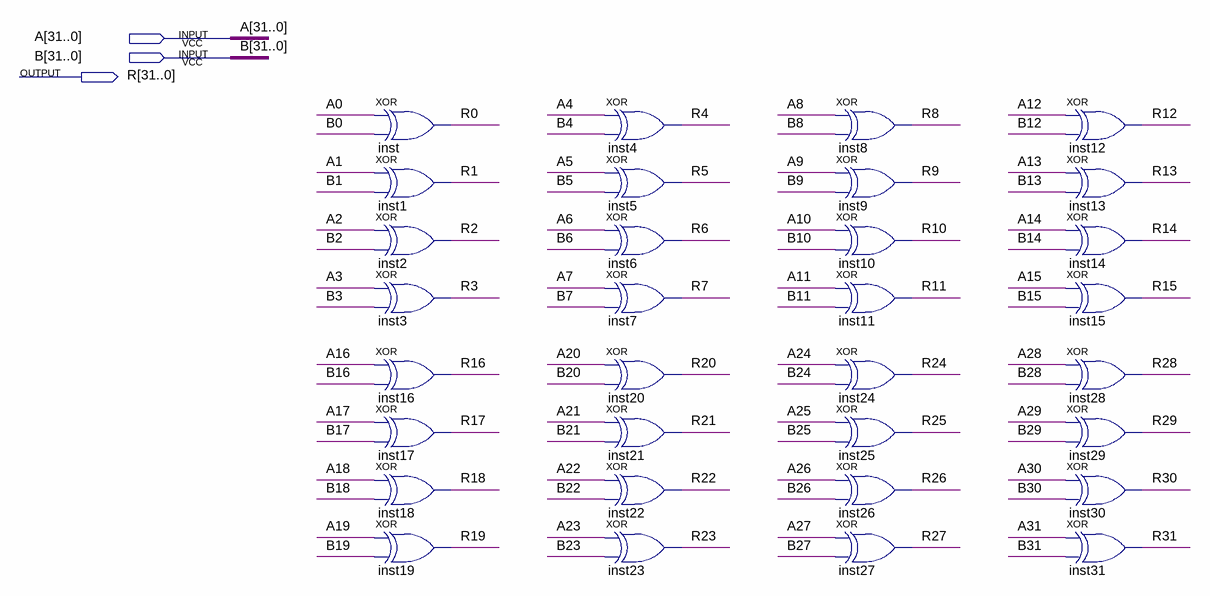
[diagram p0: schematic sheet]
// Quartus schematic xor_32_bit.bdf as structural Verilog: 32 symbols, 3 pins
module xor_32_bit (
  input  [31:0] A,
  input  [31:0] B,
  output [31:0] R
);

  xor inst (R[0], A[0], B[0]);
  xor inst1 (R[1], A[1], B[1]);
  xor inst2 (R[2], A[2], B[2]);
  xor inst3 (R[3], A[3], B[3]);
  xor inst16 (R[16], A[16], B[16]);
  xor inst17 (R[17], A[17], B[17]);
  xor inst18 (R[18], A[18], B[18]);
  xor inst19 (R[19], A[19], B[19]);
  xor inst4 (R[4], A[4], B[4]);
  xor inst5 (R[5], A[5], B[5]);
  xor inst6 (R[6], A[6], B[6]);
  xor inst7 (R[7], A[7], B[7]);
  xor inst20 (R[20], A[20], B[20]);
  xor inst21 (R[21], A[21], B[21]);
  xor inst22 (R[22], A[22], B[22]);
  xor inst23 (R[23], A[23], B[23]);
  xor inst8 (R[8], A[8], B[8]);
  xor inst9 (R[9], A[9], B[9]);
  xor inst10 (R[10], A[10], B[10]);
  xor inst11 (R[11], A[11], B[11]);
  xor inst24 (R[24], A[24], B[24]);
  xor inst25 (R[25], A[25], B[25]);
  xor inst26 (R[26], A[26], B[26]);
  xor inst27 (R[27], A[27], B[27]);
  xor inst12 (R[12], A[12], B[12]);
  xor inst13 (R[13], A[13], B[13]);
  xor inst14 (R[14], A[14], B[14]);
  xor inst15 (R[15], A[15], B[15]);
  xor inst28 (R[28], A[28], B[28]);
  xor inst29 (R[29], A[29], B[29]);
  xor inst30 (R[30], A[30], B[30]);
  xor inst31 (R[31], A[31], B[31]);
endmodule
